# Altium schematic sheet Sch-Final.SchDoc
size A4; SheetNumber: 1; SheetTotal: 1
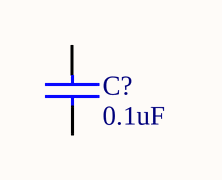
[diagram p0: Sch-Final.SchDoc]

## Parts
C?  value 0.1uF  [0603_cap]  (hidden comment: 0.1uF 50V)

## Nets

Not connected (* = marked no-connect by the designer): C? 1 2

## Library data of the parts
C? = Cap_0.1uF_0603_50V: 50V 100nF Y5V -20%~+80% 0603 Multilayer Ceramic Capacitors MLCC - SMD/SMT ROHS; Manufacturer: Walsin Tech Corp; Manufacturer Part Number: 0603F104Z500CT; Supplier 1: LCSC; Supplier Part Number 1: C83060; ComponentLink1Description: LCSC; ComponentLink1URL: https://www.lcsc.com/product-detail/Multilayer-Ceramic-Capacitors-MLCC-SMD-SMT_Walsin-Tech-Corp-0603F104Z500CT_C83060.html